# Altium schematic sheet LM358.SchDoc
size A
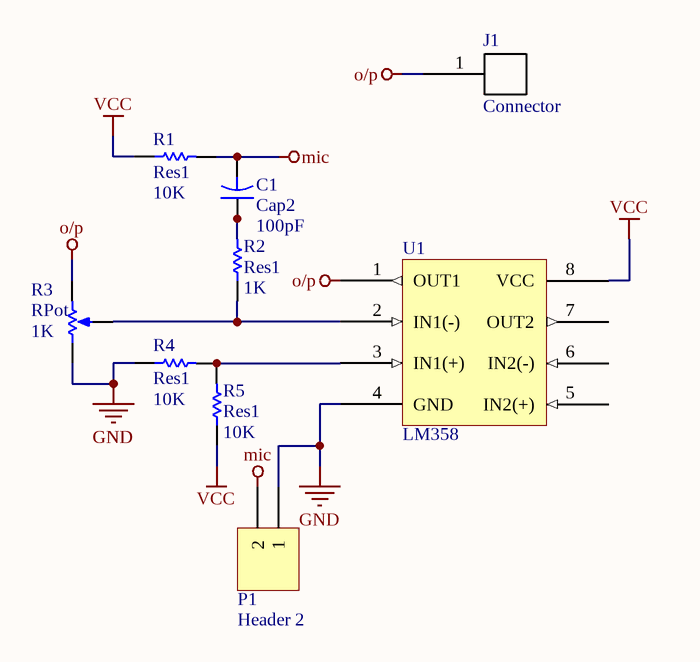
[diagram p0: LM358.SchDoc]

## Parts
C1  Cap2  value 100pF  [CAPR5-4X5]
J1  Connector  [connector]
P1  Header 2  [HDR1X2]
R1  Res1  value 10K  [AXIAL-0.3]
R2  Res1  value 1K  [AXIAL-0.3]
R3  RPot  value 1K  [VR5]
R4  Res1  value 10K  [AXIAL-0.3]
R5  Res1  value 10K  [AXIAL-0.3]
U1  LM358  [LM358]

## Nets
GND: P1.1 R3.1(TOP) R4.1 U1.4(GND)
mic: C1.2 P1.2 R1.2
o/p: J1.1 R3.2(BOT) U1.1(OUT1)
VCC: R1.1 R5.1 U1.8(VCC)
NetC1_1: C1.1 R2.2
NetR2_1: R2.1 R3.3(TAP) U1.2(IN1(-))
NetR4_2: R4.2 R5.2 U1.3(IN1(+))

Not connected (* = marked no-connect by the designer): U1 5(IN2(+)) 6(IN2(-)) 7(OUT2)

## Library data of the parts
C1 = Cap2: Capacitor; Published: 23-Sep-2002; PackageReference: CAPR5-4X5; Publisher: Altium Limited; PackageDescription: Capacitor; 2 Leads
P1 = Header 2: Header, 2-Pin; LatestRevisionDate: 17-Jul-2002; LatestRevisionNote: Re-released for DXP Platform.; Publisher: Altium Limited
R1 R2 R4 R5 = Res1: Resistor; Published: 8-Jun-2000; LatestRevisionDate: 17-Jul-2002; LatestRevisionNote: Re-released for DXP Platform.; PackageReference: AXIAL-0.3; Publisher: Altium Limited; PackageDescription: Axial Device, Thru-Hole; 2 Leads; 0.3 in Pin Spacing
R3 = RPot: Potentiometer; Sim Note: Enter the Resistance value and the set point into parameter fields.; Set Position: 0.5; Published: 8-Jun-2000; LatestRevisionDate: 17-Jul-2002; LatestRevisionNote: Re-released for DXP Platform.; PackageReference: VR5; Publisher: Altium Limited; PackageDescription: Variable Resistor, Thru-Hole; 3 Leads